# Altium schematic sheet ArbPwrBoost_P2.SchDoc: =ProjectTitle
size B; Engineer: Hab S Collector; Address1: 3621 Gin Way; Address2: Snellville GA, 30039; SheetNumber: 2; SheetTotal: 8
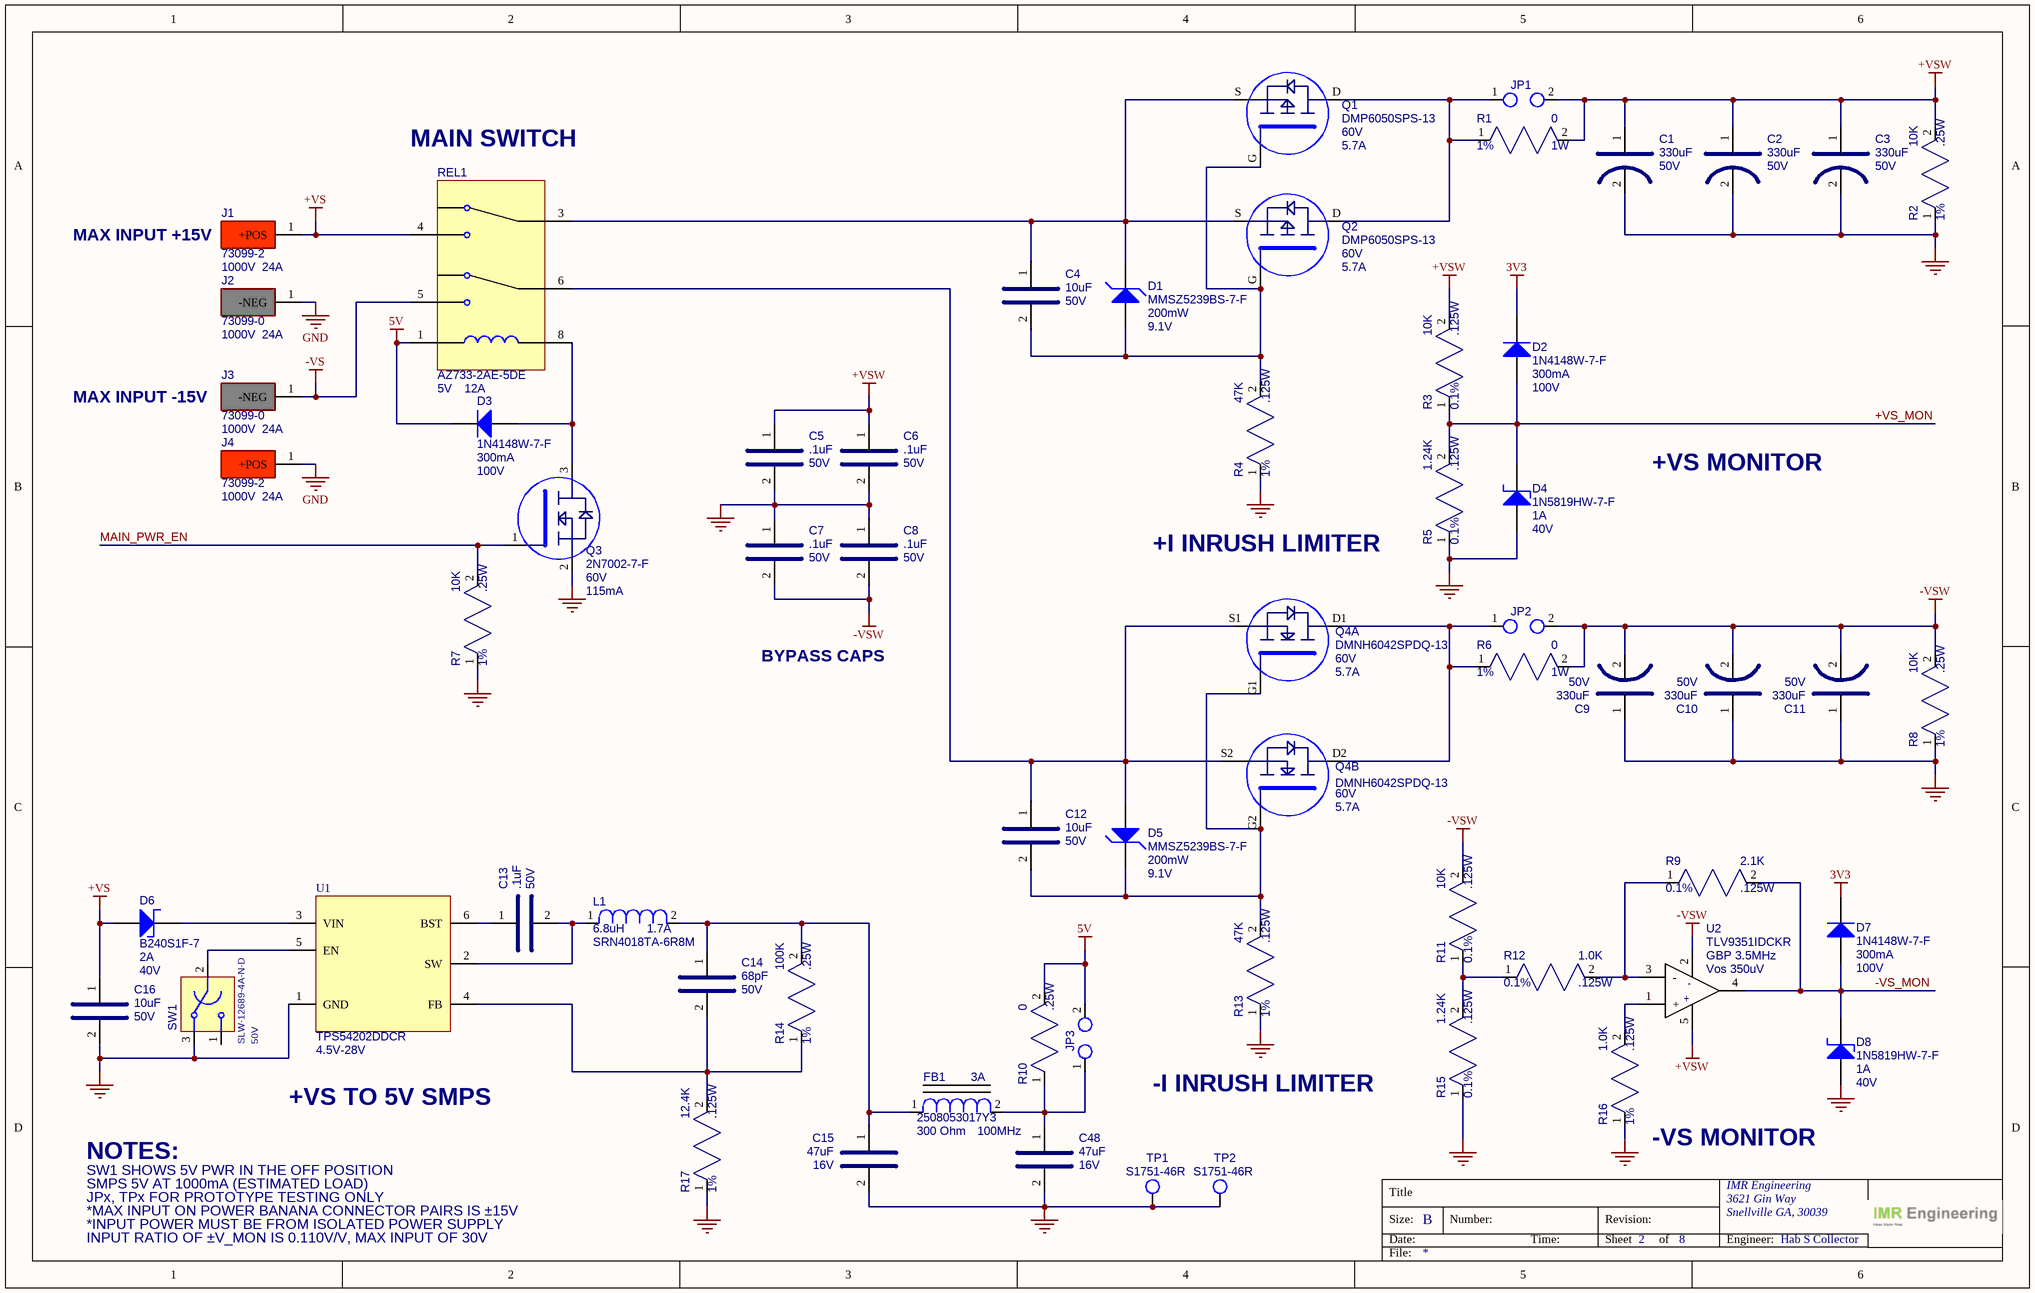
[diagram p0: ArbPwrBoost_P2.SchDoc]

## Parts
C1  value 330uF  Voltage: 50V  [PANASONIC_EEEFK0J332AQ]  (hidden comment: Panasonic Electronic)
C2  value 330uF  Voltage: 50V  [PANASONIC_EEEFK0J332AQ]  (hidden comment: Panasonic Electronic)
C3  value 330uF  Voltage: 50V  [PANASONIC_EEEFK0J332AQ]  (hidden comment: Panasonic Electronic)
C4  value 10uF  Voltage: 50V  [CAP_0805]  (hidden comment: GRM21BR61H106KE43L)
C5  value .1uF  Voltage: 50V  [CAP_0805]  (hidden comment: KGM21NR71H104KT)
C6  value .1uF  Voltage: 50V  [CAP_0805]  (hidden comment: KGM21NR71H104KT)
C7  value .1uF  Voltage: 50V  [CAP_0805]  (hidden comment: KGM21NR71H104KT)
C8  value .1uF  Voltage: 50V  [CAP_0805]  (hidden comment: KGM21NR71H104KT)
C9  value 330uF  Voltage: 50V  [PANASONIC_EEEFK0J332AQ]  (hidden comment: Panasonic Electronic)
C10  value 330uF  Voltage: 50V  [PANASONIC_EEEFK0J332AQ]  (hidden comment: Panasonic Electronic)
C11  value 330uF  Voltage: 50V  [PANASONIC_EEEFK0J332AQ]  (hidden comment: Panasonic Electronic)
C12  value 10uF  Voltage: 50V  [CAP_0805]  (hidden comment: GRM21BR61H106KE43L)
C13  value .1uF  Voltage: 50V  [CAP_0805]  (hidden comment: KGM21NR71H104KT)
C14  value 68pF  Voltage: 50V  [CAP_0805]  (hidden comment: C0805C680K5RACAUTO)
C15  value 47uF  Voltage: 16V  [CAP_1210]  (hidden comment: GRM32ER60J476ME20L)
C16  value 10uF  Voltage: 50V  [CAP_0805]  (hidden comment: GRM21BR61H106KE43L)
C48  value 47uF  Voltage: 16V  [CAP_1210]  (hidden comment: GRM32ER60J476ME20L)
D1  value 9.1V  Power: 200mW  [SOD323]  (hidden comment: MMSZ5239BS-7-F)
D2  value 100V  Current: 300mA  [SOD123]  (hidden comment: 1N4148W-7-F)
D3  value 100V  Current: 300mA  [SOD123]  (hidden comment: 1N4148W-7-F)
D4  value 40V  Current: 1A  [SOD123]  (hidden comment: 1N5819HW-7-F)
D5  value 9.1V  Power: 200mW  [SOD323]  (hidden comment: MMSZ5239BS-7-F)
D6  value 40V  Current: 2A  [SOD123F]  (hidden comment: B240S1F-7)
D7  value 100V  Current: 300mA  [SOD123]  (hidden comment: 1N4148W-7-F)
D8  value 40V  Current: 1A  [SOD123]  (hidden comment: 1N5819HW-7-F)
FB1  value 300 Ohm  Frequency: 100MHz  Current: 3A  [FERRITE_0805]  (hidden comment: 2508053017Y3)
J1  value 1000V  Current: 24A  [Pomona_73099-2]  (hidden comment: 73099-2)
J2  value 1000V  Current: 24A  [Pomona_73099-0]  (hidden comment: 73099-0)
J3  value 1000V  Current: 24A  [Pomona_73099-0]  (hidden comment: 73099-0)
J4  value 1000V  Current: 24A  [Pomona_73099-2]  (hidden comment: 73099-2)
JP1  PREC002SFAN-RC  [HDR_1X2_100MILL]  (value not drawn)
JP2  PREC002SFAN-RC  [HDR_1X2_100MILL]  (value not drawn)
JP3  PREC002SFAN-RC  [HDR_1X2_100MILL]  (value not drawn)
L1  value 6.8uH  Current: 1.7A  [SRN4018TA]  (hidden comment: SRN4018TA-6R8M)
Q1  value 60V  Current: 5.7A  [DMP3007SPS13]  (hidden comment: DMP6050SPS-13)
Q2  value 60V  Current: 5.7A  [DMP3007SPS13]  (hidden comment: DMP6050SPS-13)
Q3  value 60V  Current: 115mA  [SOT-23]  (hidden comment: 2N7002-7-F)
Q4  value 60V  Current: 5.7A  [TRANS_DMP2002UPS-13]  (hidden comment: DMNH6042SPDQ-13)  (parts A,B of 2)
R1  value 0  Tolerance: 1%  Power: 1W  [RES_2512]  (hidden comment: RC2512JK-070RL)
R2  value 10K  Power: .25W  Tolerance: 1%  [RES_0805]  (hidden comment: RC0805FR-7W10KL)
R3  value 10K  Power: .125W  Tolerance: 0.1%  [RES_0805]  (hidden comment: RP0805BRD0710KL)
R4  value 47K  Power: .125W  Tolerance: 1%  [RES_0805]  (hidden comment: RC0805FR-1347KL)
R5  value 1.24K  Power: .125W  Tolerance: 0.1%  [RES_0805]  (hidden comment: RT0805BRD071K24L)
R6  value 0  Tolerance: 1%  Power: 1W  [RES_2512]  (hidden comment: RC2512JK-070RL)
R7  value 10K  Power: .25W  Tolerance: 1%  [RES_0805]  (hidden comment: RC0805FR-7W10KL)
R8  value 10K  Power: .25W  Tolerance: 1%  [RES_0805]  (hidden comment: RC0805FR-7W10KL)
R9  value 2.1K  Power: .125W  Tolerance: 0.1%  [RES_0805]  (hidden comment: RT0805BRD072K1L)
R10  value 0  Power: .25W  [RES_0805]  (hidden comment: RC0805JR-070RL)
R11  value 10K  Power: .125W  Tolerance: 0.1%  [RES_0805]  (hidden comment: RP0805BRD0710KL)
R12  value 1.0K  Power: .125W  Tolerance: 0.1%  [RES_0805]  (hidden comment: RT0805BRD071KL)
R13  value 47K  Power: .125W  Tolerance: 1%  [RES_0805]  (hidden comment: RC0805FR-1347KL)
R14  value 100K  Power: .25W  Tolerance: 1%  [RES_0805]  (hidden comment: RC0805FR-07100KL)
R15  value 1.24K  Power: .125W  Tolerance: 0.1%  [RES_0805]  (hidden comment: RT0805BRD071K24L)
R16  value 1.0K  Power: .125W  Tolerance: 1%  [RES_0805]  (hidden comment: RC0805FR-071KL)
R17  value 12.4K  Power: .125W  Tolerance: 1%  [RES_0805]  (hidden comment: RC0805FR-0712K4L)
REL1  value 5V  Current: 12A  [AZ733]  (hidden comment: AZ733-2AE-5DE)
SW1  value 50V  [SLW126894AND]  (hidden comment: SLW-12689-4A-N-D)
TP1  S1751-46R  [HARWIN_S1751]
TP2  S1751-46R  [HARWIN_S1751]
U1  value 4.5V-28V  [SOT-23-6]  (hidden comment: TPS54202DDCR)
U2  value GBP 3.5MHz  Vos: Vos 350uV  [SOT-353]  (hidden comment: TLV9351IDCKR)

## Nets
3V3: D2.2(K) D7.2(K)
5V: D3.2(K) JP3.2 R10.2 REL1.1
+VS: C16.1 D6.1(A) J1.1(+POS) REL1.4
+VSW: C1.1 C2.1 C3.1 C5.1 C6.1 JP1.2 R1.2 R2.2 R3.2 U2.5
-VS: J3.1(-NEG) REL1.5
-VSW: C7.2 C8.2 C9.2 C10.2 C11.2 JP2.2 R6.2 R8.2 R11.2 U2.2
GND: C1.2 C2.2 C3.2 C5.2 C6.2 C7.1 C8.1 C9.1 C10.1 C11.1 C15.2 C16.2 C48.2 D4.1(A) D8.1(A) J2.1(-NEG) J4.1(+POS) Q3.2(E) R2.1 R4.1 R5.1 R7.1 R8.1 R13.1 R15.1 R16.1 R17.1 SW1.3 TP1.1 TP2.1 U1.1(GND)
+VS_MON: D2.1(A) D4.2(K) R3.1 R5.2
-VS_MON: D7.1(A) D8.2(K) R9.2 U2.4
MAIN_PWR_EN: Q3.1(B) R7.2
NetC4_1: C4.1 D1.2(K) Q1.S Q2.S REL1.3
NetC4_2: C4.2 D1.1(A) Q1.G Q2.G R4.2
NetC12_1: C12.1 D5.1(A) Q4.S1(S) Q4.S2(S) REL1.6
NetC12_2: C12.2 D5.2(K) Q4.G1(G) Q4.G2 R13.2
NetC13_1: C13.1 U1.6(BST)
NetC13_2: C13.2 L1.1 U1.2(SW)
NetC14_1: C14.1 C15.1 FB1.1 L1.2 R14.2
NetC14_2: C14.2 R14.1 R17.2 U1.4(FB)
NetC48_1: C48.1 FB1.2 JP3.1 R10.1
NetD3_1: D3.1(A) Q3.3(C) REL1.8
NetD6_2: D6.2(K) U1.3(VIN)
NetJP1_1: JP1.1 Q1.D Q2.D R1.1
NetJP2_1: JP2.1 Q4.D1(D) Q4.D2(D) R6.1
NetR9_1: R9.1 R12.2 U2.3(-)
NetR11_1: R11.1 R12.1 R15.2
NetR16_2: R16.2 U2.1(+)
NetSW1_2: SW1.2 U1.5(EN)

Not connected (* = marked no-connect by the designer): SW1 1

## Notes on the sheet
- MAIN SWITCH
- MAX INPUT +15V
- MAX INPUT -15V
- +VS MONITOR
- +I INRUSH LIMITER
- BYPASS CAPS
- +VS TO 5V SMPS
- -I INRUSH LIMITER
- NOTES:
- SW1 SHOWS 5V PWR IN THE OFF POSITION
- (near R16) -VS MONITOR
- JPx, TPx FOR PROTOTYPE TESTING ONLY
- *MAX INPUT ON POWER BANANA CONNECTOR PAIRS IS ±15V
- *INPUT POWER MUST BE FROM ISOLATED POWER SUPPLY
- INPUT RATIO OF ±V_MON IS 0.110V/V, MAX INPUT OF 30V
- SMPS 5V AT 1000mA (ESTIMATED LOAD)
- Title
- Size:
- Date:
- B
- Number:
- Time:
- Revision:
- Sheet
- of
- IMR Engineering
- Engineer:
- File:

## Library data of the parts
C1-C3 C9-C11 = CAP_330UF_50V_ALE: CAP ALE 330UF 20% 50V SMD; MFG: EEV-FK1H331Q; Case/Package: Radial SMD; MFG_PN: Panasonic Electronic; Supplier 1: DigiKey; Supplier Part Number 1: PCE3475CT-ND; Unit Price: 1.41
C4 C12 C16 = CAP_SMD_10UF_50V_0805: CAP CER 10UF 50V X5R 0805; MFG: Murata Electronics; Case/Package: 0805; MFG_PN: GRM21BR61H106KE43L; Supplier 1: DigiKey; Supplier Part Number 1: 490-18663-1-ND; Unit Price: .28
C5-C8 C13 = CAP_SMD_0.1UF_50V_0805: CAP CER 0.1UF 50V X7R 0805; MFG: KYOCERA AVX; Case/Package: 0805; MFG_PN: KGM21NR71H104KT; Supplier 1: DigiKey; Supplier Part Number 1: 478-KGM21NR71H104KTCT-ND; Unit Price: .1
C14 = CAP_SMD_68PF_50V_0805: CAP CER 68PF 50V X7R 0805; MFG: KEMET; Case/Package: 0805; MFG_PN: C0805C680K5RACAUTO; Supplier 1: DigiKey; Supplier Part Number 1: 399-C0805C680K5RACAUTOCT-ND; Unit Price: .24
C15 C48 = CAP_SMD_47UF_16V_1210: CAP CER 47UF 50V X5R 1210; MFG: Murata Electronics; Case/Package: 1210; MFG_PN: GRM32ER60J476ME20L; Supplier 1: DigiKey; Supplier Part Number 1: 490-1887-1-ND; Unit Price: .28
D1 D5 = DIODE_ZENER_MMSZ5239BS-7-F: DIODE ZENER 9.1V 200MW SOD323; MFG: Diodes Inc; Case/Package: SOD-123; Supplier 1: DigiKey; Supplier Part Number 1: MMSZ5239BS-FDICT-ND; Unit Price: .18; MFG_PN: MMSZ5239BS-7-F
D2 D3 D7 = DIODE_1N4148W-7-F: RELAY REED SPDT 250MA 5V; MFG: Diodes Inc; Case/Package: SOD-123; Supplier 1: DigiKey; Supplier Part Number 1: 1N4148W-FDICT-ND; Unit Price: .16; MFG_PN: 1N4148W-7-F
D4 D8 = DIODE_SCHOTTKY_1N5819HW-7-F: DIODE SCHOTTKY 40V 1A SOD123; MFG: Diodes Inc; Case/Package: SOD-123; Supplier 1: DigiKey; Supplier Part Number 1: 1N5819HW-FDICT-ND; Unit Price: .25; MFG_PN: 1N5819HW-7-F
D6 = DIODE_SCHOTTKY_B240S1F-7: DIODE SCHOTTKY 40V 2A SOD123F; MFG: Diodes Inc; Case/Package: SOD-123F; Supplier 1: DigiKey; Supplier Part Number 1: B240S1F-7DICT-ND; Unit Price: .25; MFG_PN: B240S1F-7
FB1 = FERRITE_2508053017Y3: FERRITE BEAD 300 OHM 0805 1LN; MFG: Fair-Rite; Case/Package: 0805; Supplier 1: DigiKey; Supplier Part Number 1: 1934-1474-1-ND; Unit Price: .10; MFG_PN: 2508053017Y3
J1 J4 = CONN_PANOMA_73099-2: CONN 4mm Banana Socket Right Angle PCB RED; MFG: Pomona; Case/Package: 73099-2; Supplier 1: DigiKey; Supplier Part Number 1: 501-73099-2-ND; Unit Price: 10.39; MFG_PN: 73099-2
J2 J3 = CONN_PANOMA_73099-0: CONN 4mm Banana Socket Right Angle PCB BLK; MFG: Pomona; Case/Package: 73099-0; Supplier 1: DigiKey; Supplier Part Number 1: 501-73099-0-ND; Unit Price: 10.39; MFG_PN: 73099-0
JP1-JP3 = CONN_JUMPER_2P_100MIL_VERT: CONN HEADER VERT 2POS 2.54MM; MFG: Sullins Connector Solutions; Case/Package: 2P_2.54MM; MFG_PN: PREC002SFAN-RC; Supplier 1: Digi-Key; Supplier Part Number 1: S1212EC-02-ND; Value: *; Unit Price: .07
L1 = INDUCTOR_SRN4018TA-6R8M: FIXED IND 6.8UH 1.7A 98 MOHM SMD; MFG: Bourns Inc.; Tolerance: 20%; Case/Package: SRN4018TA; Supplier 1: DigiKey; Supplier Part Number 1: SRN4018TA-6R8MCT-ND; Unit Price: .48; MFG_PN: SRN4018TA-6R8M
Q1 Q2 = MOSFET_PCH_DMP6050SPS-13: MOSFET P-CH 60V 5.7A PWRDI5060-8; MFG: Diodes Inc; Case/Package: 8-PowerTDFN; Supplier 1: DigiKey; Supplier Part Number 1: DMP6050SPS-13DICT-ND; Unit Price: 1.07; MFG_PN: DMP6050SPS-13
Q3 = MOSFET_NCH_2N7002-7-F: MOSFET N-CH 60V 115MA SOT23-3; MFG: Diodes Inc; Case/Package: SOT-23; Supplier 1: DigiKey; Supplier Part Number 1: 2N7002-FDICT-ND; Unit Price: .20; MFG_PN: 2N7002-7-F
Q4 = MOSFET_NCH_DMNH6042SPDQ-13: MOSFET NCH 60V 5.7A POWERDI; MFG: Diodes Inc; Case/Package: 8-PowerTDFN; Supplier 1: DigiKey; Supplier Part Number 1: DMNH6042SPDQ-13DICT-ND; Unit Price: 1.36; MFG_PN: DMNH6042SPDQ-13
R1 R6 = RES_SMD_0_2512_1W_1%: RES SMD 0 OHM 1% 1W 2512; MFG: Yageo; Case/Package: 2512; MFG_PN: RC2512JK-070RL; Supplier 1: DigiKey; Supplier Part Number 1: YAG1232CT-ND; Unit Price: .2
R2 R7 R8 = RES_SMD_10K_0805_1/4W_1%: RES SMD 10K OHM 1% 1/4W 0805; MFG: Yageo; Case/Package: 0805; MFG_PN: RC0805FR-7W10KL; Supplier 1: DigiKey; Supplier Part Number 1: 13-RC0805FR-7W10KLCT-ND; Unit Price: .10
R3 R11 = RES_SMD_10K_0805_1/8W_0.1%: RES SMD 10K OHM 0.1% 1/8W 0805; MFG: Yageo; Case/Package: 0805; MFG_PN: RP0805BRD0710KL; Supplier 1: DigiKey; Supplier Part Number 1: 13-RP0805BRD0710KLCT-ND; Unit Price: .16
R4 R13 = RES_SMD_47K_0805_1/8W_1%: RES SMD 47K OHM 1% 1/8W 0805; MFG: Yageo; Case/Package: 0805; MFG_PN: RC0805FR-1347KL; Supplier 1: DigiKey; Supplier Part Number 1: 13-RC0805FR-1347KLCT-ND; Unit Price: .1
R5 R15 = RES_SMD_1.24K_0805_1/8W_0.1%: RES SMD 1.24K OHM 0.1% 1/8W 0805; MFG: Yageo; Case/Package: 0805; MFG_PN: RT0805BRD071K24L; Supplier 1: DigiKey; Supplier Part Number 1: YAG1809CT-ND; Unit Price: .16
R9 = RES_SMD_2.1K_0805_1/8W_0.1%: RES SMD 2.1K OHM 0.1% 1/8W 0805; MFG: Yageo; Case/Package: 0805; MFG_PN: RT0805BRD072K1L; Supplier 1: DigiKey; Supplier Part Number 1: YAG1852CT-ND; Unit Price: .16
R10 = RES_SMD_0_0805_1/8W_1%: RES SMD 0 OHM 1% 1/8W 0805; MFG: Yageo; Case/Package: 0805; MFG_PN: RC0805JR-070RL; Supplier 1: DigiKey; Supplier Part Number 1: 311-0.0ARCT-ND; Unit Price: .1; Tolerance: 1%
R12 = RES_SMD_1.0K_0805_1/8W_0.1%: RES SMD 1.0K OHM 0.1% 1/8W 0805; MFG: Yageo; Case/Package: 0805; MFG_PN: RT0805BRD071KL; Supplier 1: DigiKey; Supplier Part Number 1: YAG1820CT-ND; Unit Price: .16
R14 = RES_SMD_100K_0805_1/4W_1%: RES SMD 100K OHM 1% 1/4W 0805; MFG: Yageo; Case/Package: 0805; MFG_PN: RC0805FR-07100KL; Supplier 1: DigiKey; Supplier Part Number 1: 311-100KCRCT-ND; Unit Price: .13
R16 = RES_SMD_1.0K_0805_1/8W_1%: RES SMD 1.0K OHM 1% 1/8W 0805; MFG: Yageo; Case/Package: 0805; MFG_PN: RC0805FR-071KL; Supplier 1: DigiKey; Supplier Part Number 1: 311-1.00KCRCT-ND; Unit Price: .1
R17 = RES_SMD_12.4K_0805_1/8W_1%: RES SMD 12.4K OHM 1% 1/8W 0805; MFG: Yageo; Case/Package: 0805; MFG_PN: RC0805FR-0712K4L; Supplier 1: DigiKey; Supplier Part Number 1: 311-12.4KCRCT-ND; Unit Price: .10
REL1 = RELAY_AZ733-2AE-5DE: RELAY REED SPDT 250MA 5V; MFG: American Zettler; Case/Package: AZ733; Supplier 1: DigiKey; Supplier Part Number 1: 3385-AZ733-2AE-5DE-nd; Unit Price: 2.18; MFG_PN: AZ733-2AE-5DE
SW1 = SWITCH_SLW-12689-4A-N-D: SWITCH SLIDE SPDT 300MA 50V; MFG: Same Sky; Case/Package: SLW-12689-4A-N-D; Supplier 1: DigiKey; Supplier Part Number 1: 2223-SLW-12689-4A-N-D-ND; Unit Price: .48; Current: 300mA; MFG_PN: SLW-12689-4A-N-D
TP1 TP2 = CONN_TEST_POINT_S1751-46R: PCB TEST POINT CONNECT; MFG: Harwin Inc; Case/Package: S1751; MFG_PN: S1751-46R; Supplier 1: Digi-Key; Supplier Part Number 1: 952-1478-1-ND; Value: *; Unit Price: .28
U1 = IC_TPS54202DDCR: IC REG BUCK ADJ 2A SOT23; MFG: Texas Instruments; Case/Package: SOT-23-6; Supplier 1: Digi-Key; Supplier Part Number 1: 296-TPS54202DDCRCT-ND; Unit Price: .97; MFG_PN: TPS54202DDCR
U2 = OPAMP_TLV9351IDCKR: IC OPAMP GP 3.5MHZ 350uV C70-5; MFG: Texas Instruments; Package/Case: SOT-353; Supplier 1: DigiKey; MFG_PN: TLV9351IDCKR; Unit Price: .49; Supplier Part Number 1: 296-TLV9351IDCKRCT-ND